# Altium schematic sheet FHJController_V5.0_Main.SchDoc: Main
size A3; DocumentNumber: 1; SheetNumber: 1; SheetTotal: 6
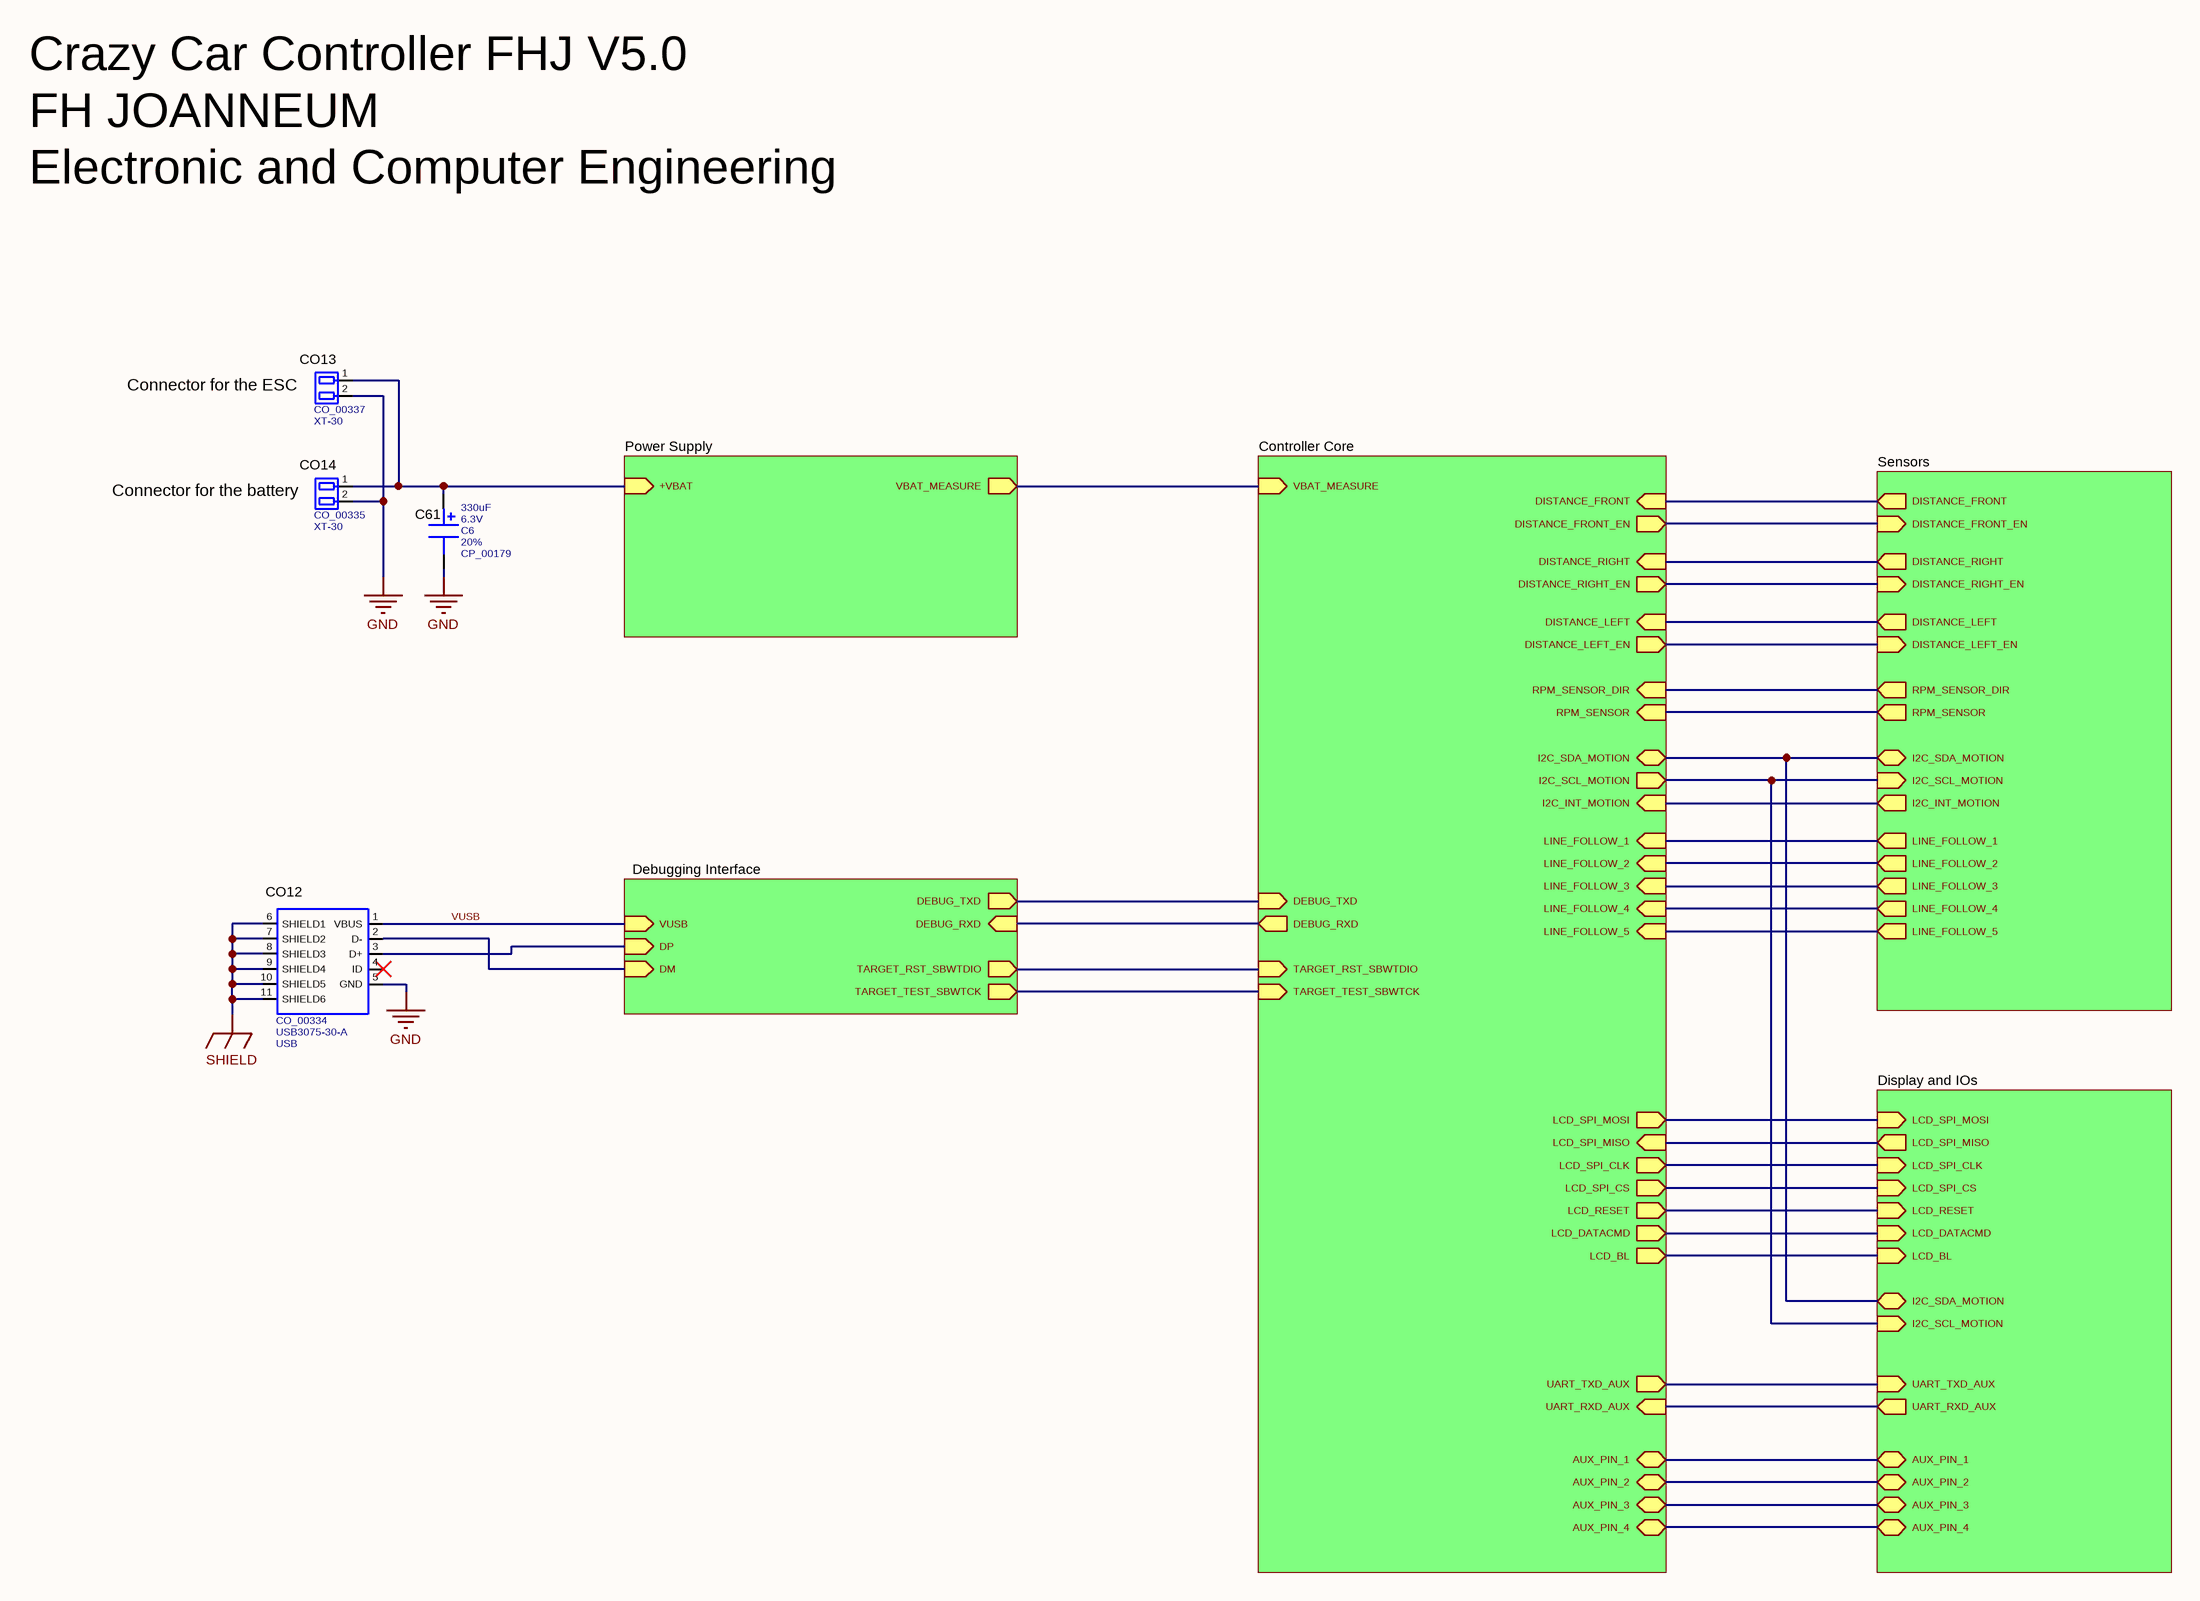
[diagram p0: FHJController_V5.0_Main.SchDoc]

## Parts
C61  Capacitance: 330uF  Voltage: 6.3V  Package: C6  Tolerance: 20%  Part_Number: CP_00179  [CP_00179L]  (hidden comment: capacitor_polar)
CO12  Manufacturer_Number: USB3075-30-A  Connector_Type: USB  [CO_00334N]  (hidden comment: CO_00334)
CO13  Part_Number: CO_00337  Manufacturer_Number: XT-30  [CO_00337N]  (hidden comment: header1x2)
CO14  Part_Number: CO_00335  Manufacturer_Number: XT-30  [CO_00335N]  (hidden comment: header1x2)

## Sub-sheets
? = Power Supply: +VBAT (in), VBAT_MEASURE (out)
? = Controller Core: LCD_BL (out), UART_RXD_AUX (in), LCD_SPI_CLK (out), DEBUG_RXD (out), LCD_DATACMD (out), LCD_SPI_MOSI (out), LCD_SPI_CS (out), DEBUG_TXD (in), LCD_RESET (out), LCD_SPI_MISO (in), TARGET_RST_SBWTDIO (in), UART_TXD_AUX (out), I2C_SCL_MOTION (out), I2C_INT_MOTION (in), I2C_SDA_MOTION (bidir), RPM_SENSOR (in), RPM_SENSOR_DIR (in), DISTANCE_FRONT (in), DISTANCE_FRONT_EN (out), DISTANCE_RIGHT (in), DISTANCE_RIGHT_EN (out), DISTANCE_LEFT (in), DISTANCE_LEFT_EN (out), VBAT_MEASURE (in), LINE_FOLLOW_1 (in), LINE_FOLLOW_3 (in), LINE_FOLLOW_2 (in), LINE_FOLLOW_4 (in), LINE_FOLLOW_5 (in), TARGET_TEST_SBWTCK (in), AUX_PIN_2 (bidir), AUX_PIN_4 (bidir), AUX_PIN_3 (bidir), AUX_PIN_1 (bidir)
? = Debugging Interface: VUSB (in), DP (in), DM (in), DEBUG_TXD (out), DEBUG_RXD (in), TARGET_TEST_SBWTCK (out), TARGET_RST_SBWTDIO (out)
? = Sensors: RPM_SENSOR_DIR (out), RPM_SENSOR (out), DISTANCE_FRONT (out), DISTANCE_RIGHT (out), DISTANCE_LEFT (out), I2C_SDA_MOTION (bidir), I2C_SCL_MOTION (in), DISTANCE_RIGHT_EN (in), DISTANCE_FRONT_EN (in), DISTANCE_LEFT_EN (in), LINE_FOLLOW_5 (out), LINE_FOLLOW_1 (out), LINE_FOLLOW_3 (out), LINE_FOLLOW_2 (out), LINE_FOLLOW_4 (out), I2C_INT_MOTION (out)
? = Display and IOs: LCD_SPI_CLK (in), UART_TXD_AUX (in), LCD_SPI_MOSI (in), LCD_BL (in), LCD_SPI_CS (in), LCD_DATACMD (in), UART_RXD_AUX (out), LCD_RESET (in), LCD_SPI_MISO (out), I2C_SCL_MOTION (in), I2C_SDA_MOTION (bidir), AUX_PIN_1 (bidir), AUX_PIN_3 (bidir), AUX_PIN_4 (bidir), AUX_PIN_2 (bidir)

## Nets
GND: C61.2(PIN2) CO12.5(GND) CO13.2(PIN2) CO14.2(PIN2)
SHIELD: CO12.6(SHIELD1) CO12.7(SHIELD2) CO12.8(SHIELD3) CO12.9(SHIELD4) CO12.10(SHIELD5) CO12.11(SHIELD6)
VUSB: CO12.1(VBUS) ; sheet /VUSB
NetC61_1: C61.1(PIN1) CO13.1(PIN1) CO14.1(PIN1) ; sheet /+VBAT
NetCO12_2: CO12.2(D-) ; sheet /DM
NetCO12_3: CO12.3(D+) ; sheet /DP
(unnamed): sheet /VBAT_MEASURE, sheet /VBAT_MEASURE
(unnamed): sheet /LCD_BL, sheet /LCD_BL
(unnamed): sheet /UART_RXD_AUX, sheet /UART_RXD_AUX
(unnamed): sheet /LCD_SPI_CLK, sheet /LCD_SPI_CLK
(unnamed): sheet /DEBUG_RXD, sheet /DEBUG_RXD
(unnamed): sheet /LCD_DATACMD, sheet /LCD_DATACMD
(unnamed): sheet /LCD_SPI_MOSI, sheet /LCD_SPI_MOSI
(unnamed): sheet /LCD_SPI_CS, sheet /LCD_SPI_CS
(unnamed): sheet /DEBUG_TXD, sheet /DEBUG_TXD
(unnamed): sheet /LCD_RESET, sheet /LCD_RESET
(unnamed): sheet /LCD_SPI_MISO, sheet /LCD_SPI_MISO
(unnamed): sheet /TARGET_RST_SBWTDIO, sheet /TARGET_RST_SBWTDIO
(unnamed): sheet /UART_TXD_AUX, sheet /UART_TXD_AUX
(unnamed): sheet /I2C_SCL_MOTION, sheet /I2C_SCL_MOTION, sheet /I2C_SCL_MOTION
(unnamed): sheet /I2C_INT_MOTION, sheet /I2C_INT_MOTION
(unnamed): sheet /I2C_SDA_MOTION, sheet /I2C_SDA_MOTION, sheet /I2C_SDA_MOTION
(unnamed): sheet /RPM_SENSOR, sheet /RPM_SENSOR
(unnamed): sheet /RPM_SENSOR_DIR, sheet /RPM_SENSOR_DIR
(unnamed): sheet /DISTANCE_FRONT, sheet /DISTANCE_FRONT
(unnamed): sheet /DISTANCE_FRONT_EN, sheet /DISTANCE_FRONT_EN
(unnamed): sheet /DISTANCE_RIGHT, sheet /DISTANCE_RIGHT
(unnamed): sheet /DISTANCE_RIGHT_EN, sheet /DISTANCE_RIGHT_EN
(unnamed): sheet /DISTANCE_LEFT, sheet /DISTANCE_LEFT
(unnamed): sheet /DISTANCE_LEFT_EN, sheet /DISTANCE_LEFT_EN
(unnamed): sheet /LINE_FOLLOW_1, sheet /LINE_FOLLOW_1
(unnamed): sheet /LINE_FOLLOW_3, sheet /LINE_FOLLOW_3
(unnamed): sheet /LINE_FOLLOW_2, sheet /LINE_FOLLOW_2
(unnamed): sheet /LINE_FOLLOW_4, sheet /LINE_FOLLOW_4
(unnamed): sheet /LINE_FOLLOW_5, sheet /LINE_FOLLOW_5
(unnamed): sheet /TARGET_TEST_SBWTCK, sheet /TARGET_TEST_SBWTCK
(unnamed): sheet /AUX_PIN_2, sheet /AUX_PIN_2
(unnamed): sheet /AUX_PIN_4, sheet /AUX_PIN_4
(unnamed): sheet /AUX_PIN_3, sheet /AUX_PIN_3
(unnamed): sheet /AUX_PIN_1, sheet /AUX_PIN_1

Not connected (* = marked no-connect by the designer): CO12 4(ID)*

## Notes on the sheet
- Crazy Car Controller FHJ V5.0
- FH JOANNEUM
- Electronic and Computer Engineering
- (near CO13) Connector for the ESC
- (near CO14) Connector for the battery
- Size
- A3
- Rev
- Sheet
- of
- Date changed
- FH  JOANNEUM
- University of Applied Sciences
- Drawn by
- Title
- Check by

## Library data of the parts
C61 = CP_00179: Manufacturer_Number: 875105144010; ESR: 0R02; Dielectric_Material: Conductive Polymer Aluminum Solid; Creator: Krenn Markus; Creation_Date: 13.06.2016; Datasheet_Link: http://ibi/dxdb_partdatasheet_download.php?pid=3183
CO12 = CO_00334: Micro-USB Typ B, USB 2.0, Buchse, 5 -polig, Oberflächenmontage, Rechtwinklig; Current: 1A; Impedance: 0R03; Power: 0W; Function_type: Wire-to-Board; Connector_gender: male; Mounting_angle: 90°; Contact_Count: 5; Row_Count: 1; Contact_coating: Gold; Nominal_AC_Voltage: 100VAC; Nominal_DC_Voltage: 100VDC; Mounting: SMD; Material: Copper-Alloy; Creator: Krenn Markus; Part_Number: CO_00334; Creation_Date: 06.06.2016; Datasheet_Link: http://ibi/dxdb_partdatasheet_download.php?pid=3170
CO13 = CO_00337: DYMOND XT-30 BEC Stecker; Current: 5A; Impedance: 0R; Power: 0W; Connector_Type: Terminal Block; Function_type: Wire-to-Board; Connector_gender: female; Pitch_style: 0.005m; Mounting_angle: 0°; Contact_Count: 2; Row_Count: 1; Contact_coating: Gold; Nominal_AC_Voltage: 0VAC; Nominal_DC_Voltage: 0VDC; Mounting: Through Hole; Material: Copper-Alloy; Creator: Krenn Markus; Creation_Date: 10.06.2016; Datasheet_Link: http://ibi/dxdb_partdatasheet_download.php?pid=3181
CO14 = CO_00335: DYMOND XT-30 BEC Stecker; Current: 5A; Impedance: 0R; Power: 0W; Connector_Type: Terminal Block; Function_type: Wire-to-Board; Connector_gender: male; Pitch_style: 0.005m; Mounting_angle: 0°; Contact_Count: 2; Row_Count: 1; Contact_coating: Gold; Nominal_AC_Voltage: 0VAC; Nominal_DC_Voltage: 0VDC; Mounting: Through Hole; Material: Copper-Alloy; Creator: Krenn Markus; Creation_Date: 07.06.2016; Datasheet_Link: http://ibi/dxdb_partdatasheet_download.php?pid=3173